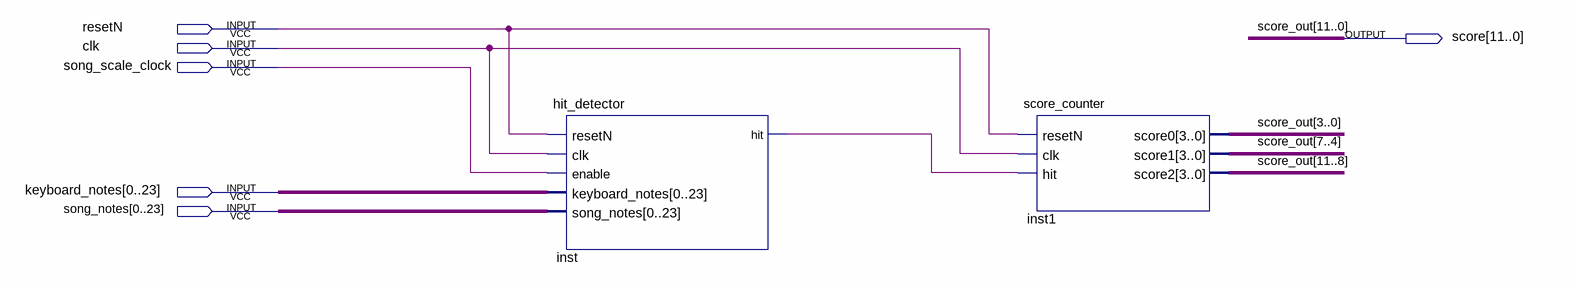
[diagram p0: schematic sheet]
// Quartus schematic score_manager.bdf as structural Verilog: 2 symbols, 6 pins
module score_manager (
  input  resetN,
  input  clk,
  input  song_scale_clock,
  input  [0:23] keyboard_notes,
  input  [0:23] song_notes,
  output [11:0] score
);

  wire inst_hit;

  hit_detector inst (
    .resetN(resetN), .clk(clk), .enable(song_scale_clock), .keyboard_notes(keyboard_notes),
    .song_notes(song_notes), .hit(inst_hit));
  score_counter inst1 (
    .resetN(resetN), .clk(clk), .hit(inst_hit), .score0(score[3:0]), .score1(score[7:4]), .score2(score[11:8]));

  // Other names for the same wires on the sheet: score_out[11:0] = score
endmodule
